# Altium schematic sheet LM7X05-SCH.SchDoc
size A4
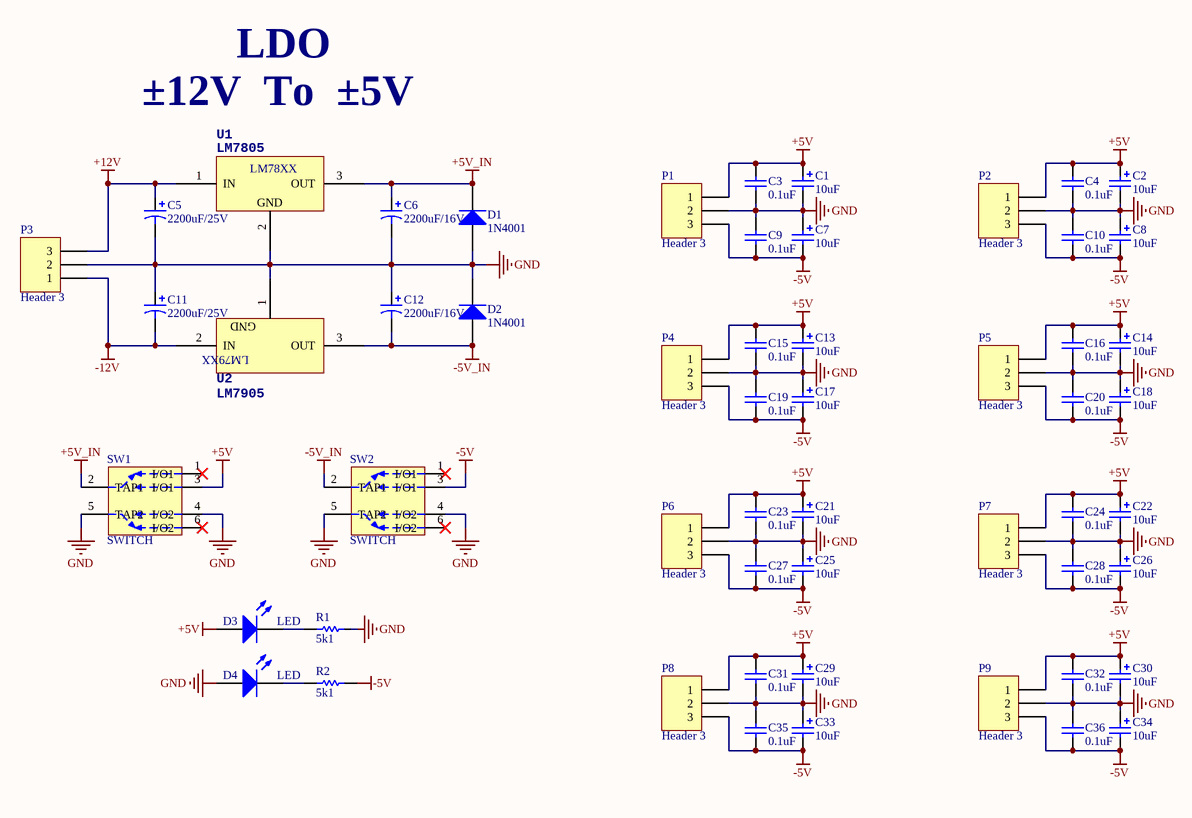
[diagram p0: LM7X05-SCH.SchDoc]

## Parts
C1  10uF  [1206T]
C2  10uF  [1206T]
C3  0.1uF  [1206C]
C4  0.1uF  [1206C]
C5  2200uF/25V  [C(16x31)]
C6  2200uF/16V  [C(16x31)]
C7  10uF  [1206T]
C8  10uF  [1206T]
C9  0.1uF  [1206C]
C10  0.1uF  [1206C]
C11  2200uF/25V  [C(16x31)]
C12  2200uF/16V  [C(16x31)]
C13  10uF  [1206T]
C14  10uF  [1206T]
C15  0.1uF  [1206C]
C16  0.1uF  [1206C]
C17  10uF  [1206T]
C18  10uF  [1206T]
C19  0.1uF  [1206C]
C20  0.1uF  [1206C]
C21  10uF  [1206T]
C22  10uF  [1206T]
C23  0.1uF  [1206C]
C24  0.1uF  [1206C]
C25  10uF  [1206T]
C26  10uF  [1206T]
C27  0.1uF  [1206C]
C28  0.1uF  [1206C]
C29  10uF  [1206T]
C30  10uF  [1206T]
C31  0.1uF  [1206C]
C32  0.1uF  [1206C]
C33  10uF  [1206T]
C34  10uF  [1206T]
C35  0.1uF  [1206C]
C36  0.1uF  [1206C]
D1  1N4001  [DIODE-10R0X2R5-1R2]
D2  1N4001  [DIODE-10R0X2R5-1R2]
D3  LED  [0603D]
D4  LED  [0603D]
P1  Header 3  [KF2EDG_3R81_3P]
P2  Header 3  [KF2EDG_3R81_3P]
P3  Header 3  [KF2EDG_3R81_3P]
P4  Header 3  [KF2EDG_3R81_3P]
P5  Header 3  [KF2EDG_3R81_3P]
P6  Header 3  [KF2EDG_3R81_3P]
P7  Header 3  [KF2EDG_3R81_3P]
P8  Header 3  [KF2EDG_3R81_3P]
P9  Header 3  [KF2EDG_3R81_3P]
R1  5k1  [R0603]
R2  5k1  [R0603]
SW1  SWITCH  [SW-8R5X8R5]
SW2  SWITCH  [SW-8R5X8R5]
U1  LM7805  [TO-220B]
U2  LM7905  [TO-220B]

## Nets
+5V: C1.1(+) C2.1(+) C3.2 C4.2 C13.1(+) C14.1(+) C15.2 C16.2 C21.1(+) C22.1(+) C23.2 C24.2 C29.1(+) C30.1(+) C31.2 C32.2 D3.1(A) P1.1 P2.1 P4.1 P5.1 P6.1 P7.1 P8.1 P9.1 SW1.3(I/O1)
+5V_IN: C6.1(+) D1.2(K) SW1.2(TAP1) U1.3(OUT)
+12V: C5.1(+) P3.3 U1.1(IN)
-5V: C7.2(-) C8.2(-) C9.1 C10.1 C17.2(-) C18.2(-) C19.1 C20.1 C25.2(-) C26.2(-) C27.1 C28.1 C33.2(-) C34.2(-) C35.1 C36.1 P1.3 P2.3 P4.3 P5.3 P6.3 P7.3 P8.3 P9.3 R2.2 SW2.3(I/O1)
-5V_IN: C12.2(-) D2.1(A) SW2.2(TAP1) U2.3(OUT)
-12V: C11.2(-) P3.1 U2.2(IN)
GND: C1.2(-) C2.2(-) C3.1 C4.1 C5.2(-) C6.2(-) C7.1(+) C8.1(+) C9.2 C10.2 C11.1(+) C12.1(+) C13.2(-) C14.2(-) C15.1 C16.1 C17.1(+) C18.1(+) C19.2 C20.2 C21.2(-) C22.2(-) C23.1 C24.1 C25.1(+) C26.1(+) C27.2 C28.2 C29.2(-) C30.2(-) C31.1 C32.1 C33.1(+) C34.1(+) C35.2 C36.2 D1.1(A) D2.2(K) D4.1(A) P1.2 P2.2 P3.2 P4.2 P5.2 P6.2 P7.2 P8.2 P9.2 R1.2 SW1.4(I/O2) SW1.5(TAP2) SW2.4(I/O2) SW2.5(TAP2) U1.2(GND) U2.1(GND)
NetD3_2: D3.2(K) R1.1
NetD4_2: D4.2(K) R2.1

Not connected (* = marked no-connect by the designer): SW1 1(I/O1)* 6(I/O2)*; SW2 1(I/O1)* 6(I/O2)*

## Notes on the sheet
- LDO
- ±12V  To  ±5V

## Library data of the parts
C1 C2 C7 C8 C13 C14 C17 C18 C21 C22 C25 C26 C29 C30 C33 C34 = Cap2: CAP TANT 10UF 10V 10% 1206; Manufacturer: KEMET; Manufacturer Part Number: T491A106K010AT7280; Manufacturer Size Code: A; Type: Molded; ESR (Equivalent Series Resistance): 3.8 Ohm; Lifetime @ Temp.: 2000 Hrs @ 125°C; Notification: Current market demand for these product types have resulted in fluctuating and extending lead times. Lead times may differ.; Supplier 1: Digi-Key; RoHS: RoHS Compliant; Category: Capacitors; Stock 1: 27000; Pricing 1: 9000=0.084, 18000=0.08138, 27000=0.07875, 63000=0.0735 (USD); Packaging: Tape & Reel (TR); Part Status: Active; Tolerance: ±10%; Operating Temperature: -55°C ~ 125°C; Mounting Type: Surface Mount; Package / Case: 1206 (3216 Metric); Size / Dimension: 0.126" L x 0.063" W (3.20mm x 1.60mm); Height - Seated (Max): 0.071" (1.80mm); Lead Spacing: -; Features: General Purpose; Failure Rate: -; ComponentLink1URL: https://api.kemet.com/component-edge/download/datasheet/T491A106K010AT7280.pdf; ComponentLink1Description: https://api.kemet.com/component-edge/download/datasheet/T491A106K010AT7280.pdf; Supplier Part Number 1: 399-8268-2-ND; Value: 10uF
C3 C4 C9 C10 C15 C16 C19 C20 C23 C24 C27 C28 C31 C32 C35 C36 = Cap1: CAP CER 10000PF 100V X7R 0603; Manufacturer: TDK Corporation; Manufacturer Part Number: C1608X7R2A103K080AA; Tolerance: ±10%; Notification: Current market demand for these product types have resulted in fluctuating and extending lead times. Lead times may differ.; Supplier 1: Digi-Key; RoHS: RoHS Compliant; Category: Capacitors; Stock 1: 40000; Pricing 1: 4000=0.01438 (USD); Packaging: Tape & Reel (TR); Part Status: Active; Voltage - Rated: 100V; Temperature Coefficient: X7R; Operating Temperature: -55°C ~ 125°C; Features: -; Ratings: -; Applications: General Purpose; Failure Rate: -; Mounting Type: Surface Mount, MLCC; Package / Case: 0603 (1608 Metric); Size / Dimension: 0.063" L x 0.032" W (1.60mm x 0.80mm); Height - Seated (Max): -; Thickness (Max): 0.035" (0.90mm); Lead Spacing: -; Lead Style: -; ComponentLink1URL: https://product.tdk.com/info/en/catalog/datasheets/mlcc_commercial_midvoltage_en.pdf; ComponentLink1Description: https://product.tdk.com/info/en/catalog/datasheets/mlcc_commercial_midvoltage_en.pdf; Supplier Part Number 1: 445-1304-2-ND; Value: 0.1uF
C5 C6 C11 C12 = Cap3: CAP ALUM POLY 150UF 20% 10V SMD; Manufacturer: KEMET; Manufacturer Part Number: A765EB157M1ALAE022; Type: Polymer; ESR (Equivalent Series Resistance): 22 mOhm; Lifetime @ Temp.: 2000 Hrs @ 105°C; Surface Mount Land Size: 0.260" L x 0.260" W (6.60mm x 6.60mm); Supplier 1: Digi-Key; RoHS: RoHS Compliant; Category: Capacitors; Stock 1: 2690; Pricing 1: 1=0.62, 10=0.44, 100=0.2899, 500=0.2147 (USD); Packaging: Cut Tape (CT); Part Status: Active; Tolerance: ±20%; Operating Temperature: -55°C ~ 105°C; Ratings: -; Applications: General Purpose; Lead Spacing: -; Size / Dimension: 0.248" Dia (6.30mm); Height - Seated (Max): 0.236" (6.00mm); Mounting Type: Surface Mount; Package / Case: Radial, Can - SMD; ComponentLink1URL: https://api.kemet.com/component-edge/download/datasheet/A765EB157M1ALAE022.pdf; ComponentLink1Description: https://api.kemet.com/component-edge/download/datasheet/A765EB157M1ALAE022.pdf; Supplier Part Number 1: 399-13671-1-ND
  C5 C11: Value: 2200uF/25V
  C6 C12: Value: 2200uF/16V
D1 D2 = Diode: Default Diode; Published: 8-Jun-2000; LatestRevisionDate: 17-Jul-2002; LatestRevisionNote: Re-released for DXP Platform.; PackageVersion: Sep-1996; PackageReference: SMC; Publisher: Altium Limited; PackageDescription: DO-214-AB/SMC; 2 C-Bend Leads; Body 7.9 x 5.9 mm, inc. leads (LxW); Code_JEDEC: DO-214-AB
D3 D4 = LED: Typical RED GaAs LED; Published: 8-Jun-2000; LatestRevisionDate: 08-Jul-2005; LatestRevisionNote: Mech Layer 1 removed.; PackageReference: LED-1; Publisher: Altium Limited; PackageDescription: LED; 2 Leads
P1-P9 = Header 3: Header, 3-Pin; LatestRevisionDate: 17-Jul-2002; LatestRevisionNote: Re-released for DXP Platform.; Publisher: Altium Limited
R1 R2 = Res1: RES SMD 1K OHM 0.5% 1/16W 0603; Manufacturer: Susumu; Manufacturer Part Number: RR0816P-102-D; Power (Watts): 0.063W, 1/16W; Temperature Coefficient: ±25ppm/°C; Supplier 1: Digi-Key; RoHS: RoHS Compliant; Category: Resistors; Stock 1: 1648842; Pricing 1: 1=0.13, 10=0.122, 100=0.0483, 1000=0.0225, 2500=0.01973 (USD); Packaging: Digi-Reel?; Part Status: Active; Tolerance: ±0.5%; Composition: Thin Film; Features: -; Operating Temperature: -55°C ~ 125°C; Package / Case: 0603 (1608 Metric); Supplier Device Package: -; Size / Dimension: 0.063" L x 0.032" W (1.60mm x 0.80mm); Height - Seated (Max): 0.020" (0.50mm); Failure Rate: -; ComponentLink1URL: http://www.susumu.co.jp/common/pdf/n_catalog_partition05_en.pdf; ComponentLink1Description: http://www.susumu.co.jp/common/pdf/n_catalog_partition05_en.pdf; Supplier Part Number 1: RR08P1.0KDDKR-ND; Value: 5k1
U1 = LM78XX
U2 = LM79XX